# EAGLE design led (EAGLE 6.5.0)
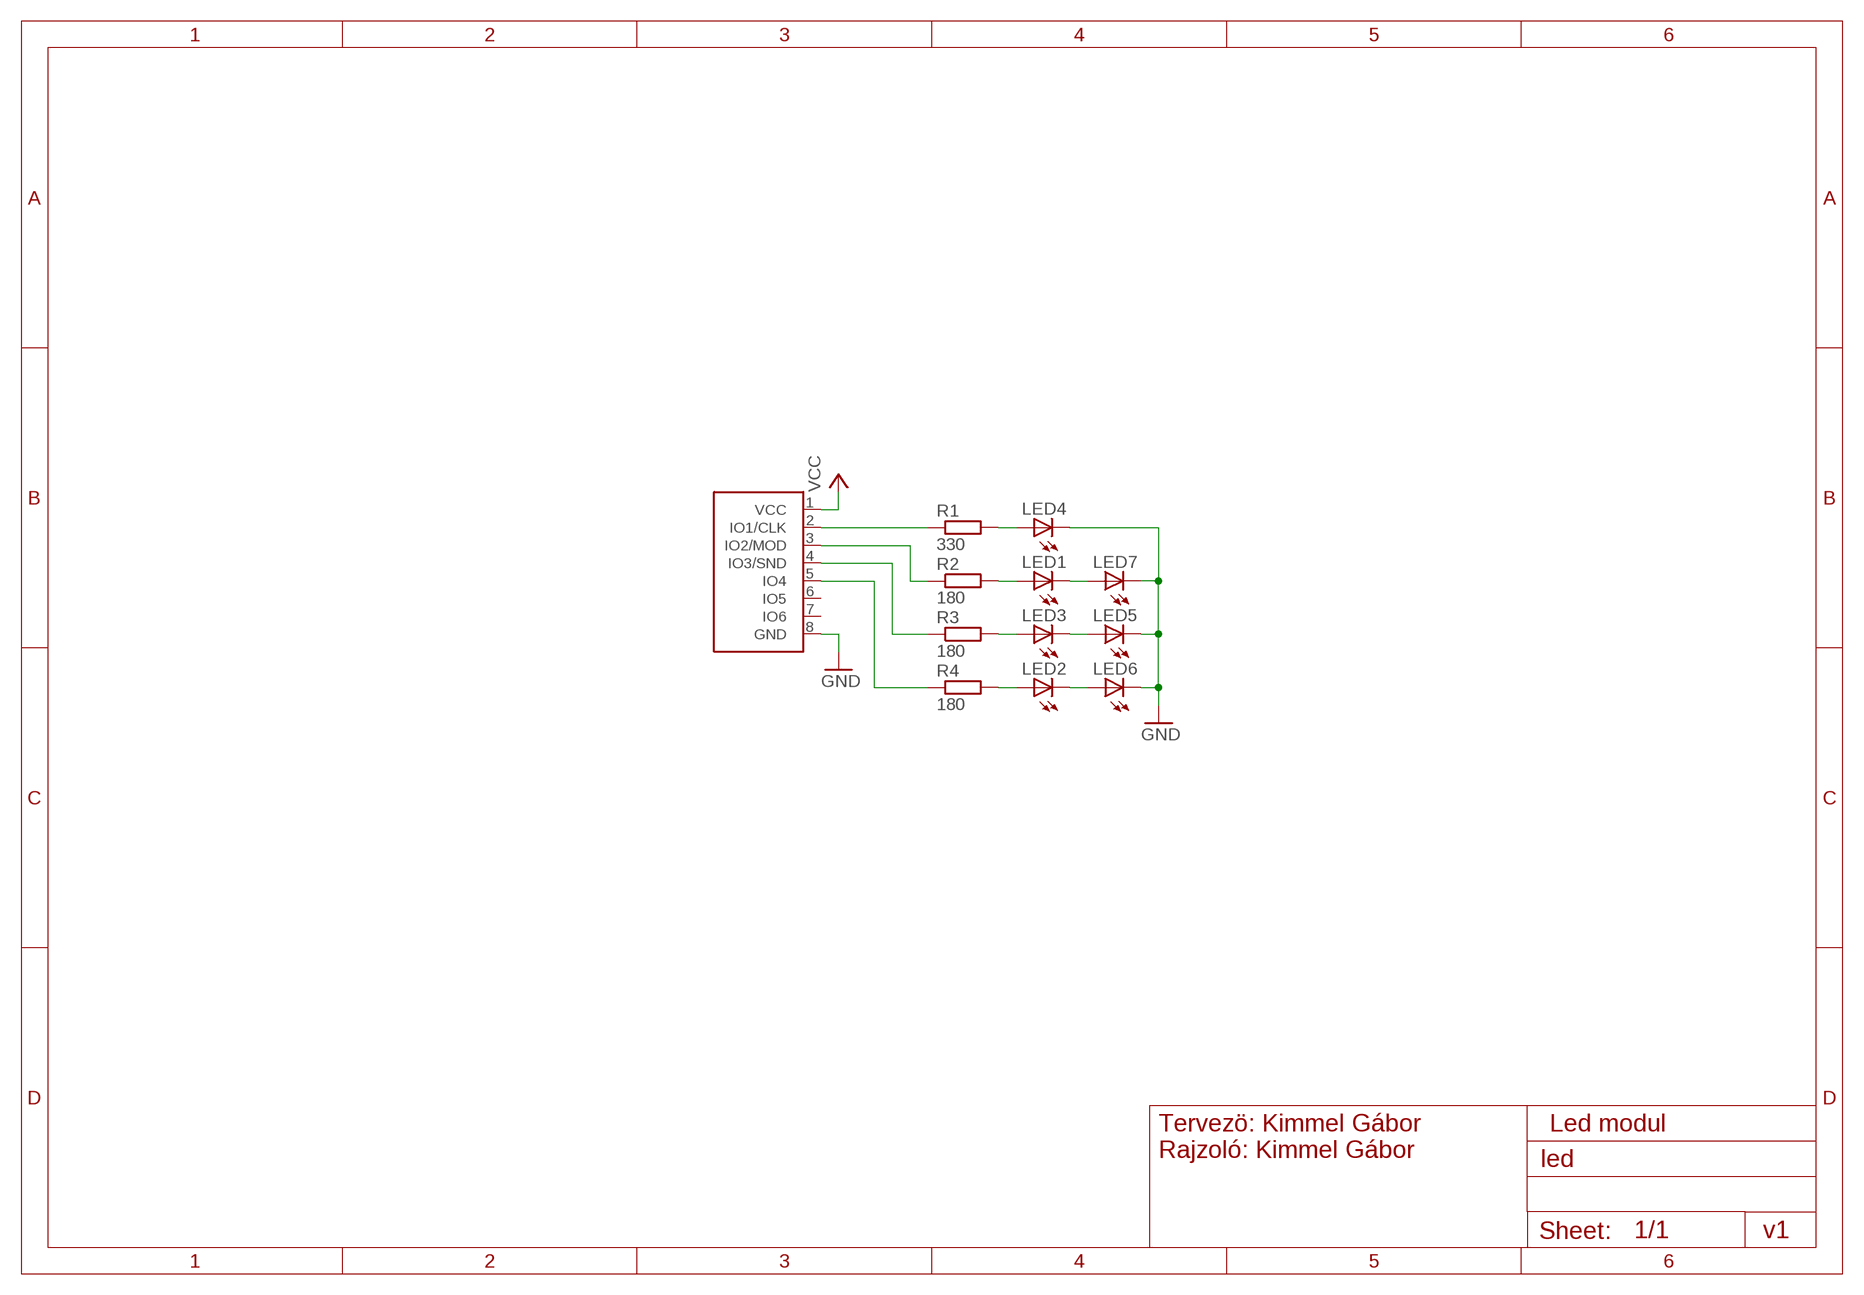
[diagram p0: schematic, sheet 1]

## Parts
LED1  LED5MM  [LED5MM]
LED2  LED5MM  [LED5MM]
LED3  LED5MM  [LED5MM]
LED4  LED5MM  [LED5MM]
LED5  LED5MM  [LED5MM]
LED6  LED5MM  [LED5MM]
LED7  LED5MM  [LED5MM]
R1  330  R-EU_0207/10  [0207/10]
R2  180  R-EU_0207/10  [0207/10]
R3  180  R-EU_0207/10  [0207/10]
R4  180  R-EU_0207/10  [0207/10]
U$1  GANZ-CONNECTOR  [FE08W]

## Nets
GND: LED4.K(C) LED5.K(C) LED6.K(C) LED7.K(C) U$1.8(GND)
N$1: R1.1 U$1.2(IO1/CLK)
N$2: LED4.A R1.2
N$3: LED1.A R2.2
N$4: LED3.A R3.2
N$5: LED2.A R4.2
N$6: LED2.K(C) LED6.A
N$7: LED3.K(C) LED5.A
N$8: LED1.K(C) LED7.A
N$9: R2.1 U$1.3(IO2/MOD)
N$10: R3.1 U$1.4(IO3/SND)
N$11: R4.1 U$1.5(IO4)
VCC: U$1.1(VCC)
Unconnected: U$1.6(IO5) U$1.7(IO6)

## Notes on the sheet
- Tervezö: Kimmel Gábor
  Rajzoló: Kimmel Gábor
- Led modul
- v1

## Library data of the parts
LED1-LED7 = led:LED: LED OSRAM: - CHIPLED LG R971, LG N971, LY N971, LG Q971, LY Q971, LO R971, LY R971 LH N974, LH R974 LS Q976, LO Q976, LY Q976 LO Q996 - Hyper CHIPLED LW Q18S LB Q993, LB Q99A, LB R99A - SideLED LS A670, LO A670, LY A670, LG A670, LP A670 LB A673, LV A673, LT A673, LW A673 LH A674 LY A675 LS A676, LA A676, LO A676, LY A676, LW A676 LS A679, LY A679, LG A679 - Hyper Micro SIDELED® LS Y876, LA Y876, LO Y876, LY Y876 LT Y87S - SmartLED LW L88C, LW L88S LB L89C, LB L89S, LG L890 LS L89K, LO L89K, LY L89K LS L896, LA L896, LO L896, LY L896 - TOPLED LS T670, LO T670, LY T670, LG T670, LP T670 LSG T670, LSP T670, LSY T670, LOP T670, LYG T670 LG T671, LOG T671, LSG T671 LB T673, LV T673, LT T673, LW T673 LH T674 LS T676, LA T676, LO T676, LY T676, LB T676, LH T676, LSB T676, LW T676 LB T67C, LV T67C, LT T67C, LS T67K, LO T67K, LY T67K, LW E67C LS E67B, LA E67B, LO E67B, LY E67B, LB E67C, LV E67C, LT E67C LW T67C LS T679, LY T679, LG T679 LS T770, LO T770, LY T770, LG T770, LP T770 LB T773, LV T773, LT T773, LW T773 LH T774 LS E675, LA E675, LY E675, LS T675 LS T776, LA T776, LO T776, LY T776, LB T776 LHGB T686 LT T68C, LB T68C - Hyper Mini TOPLED® LB M676 - Mini TOPLED Santana® LG M470 LS M47K, LO M47K, LY M47K Source: http://www.osram.convergy.de LUXEON: - LUMILED® LXK2-PW12-R00, LXK2-PW12-S00, LXK2-PW14-U00, LXK2-PW14-V00 LXK2-PM12-R00, LXK2-PM12-S00, LXK2-PM14-U00 LXK2-PE12-Q00, LXK2-PE12-R00, LXK2-PE12-S00, LXK2-PE14-T00, LXK2-PE14-U00 LXK2-PB12-K00, LXK2-PB12-L00, LXK2-PB12-M00, LXK2-PB14-N00, LXK2-PB14-P00, LXK2-PB14-Q00 LXK2-PR12-L00, LXK2-PR12-M00, LXK2-PR14-Q00, LXK2-PR14-R00 LXK2-PD12-Q00, LXK2-PD12-R00, LXK2-PD12-S00 LXK2-PH12-R00, LXK2-PH12-S00 LXK2-PL12-P00, LXK2-PL12-Q00, LXK2-PL12-R00 Source: www.luxeon.com KINGBRIGHT: KA-3528ASYC Source: www.kingbright.com
R1-R4 = resistor:R-EU_: RESISTOR, European symbol
U$1 = ganzlib:GANZ-CONNECTOR

## Board
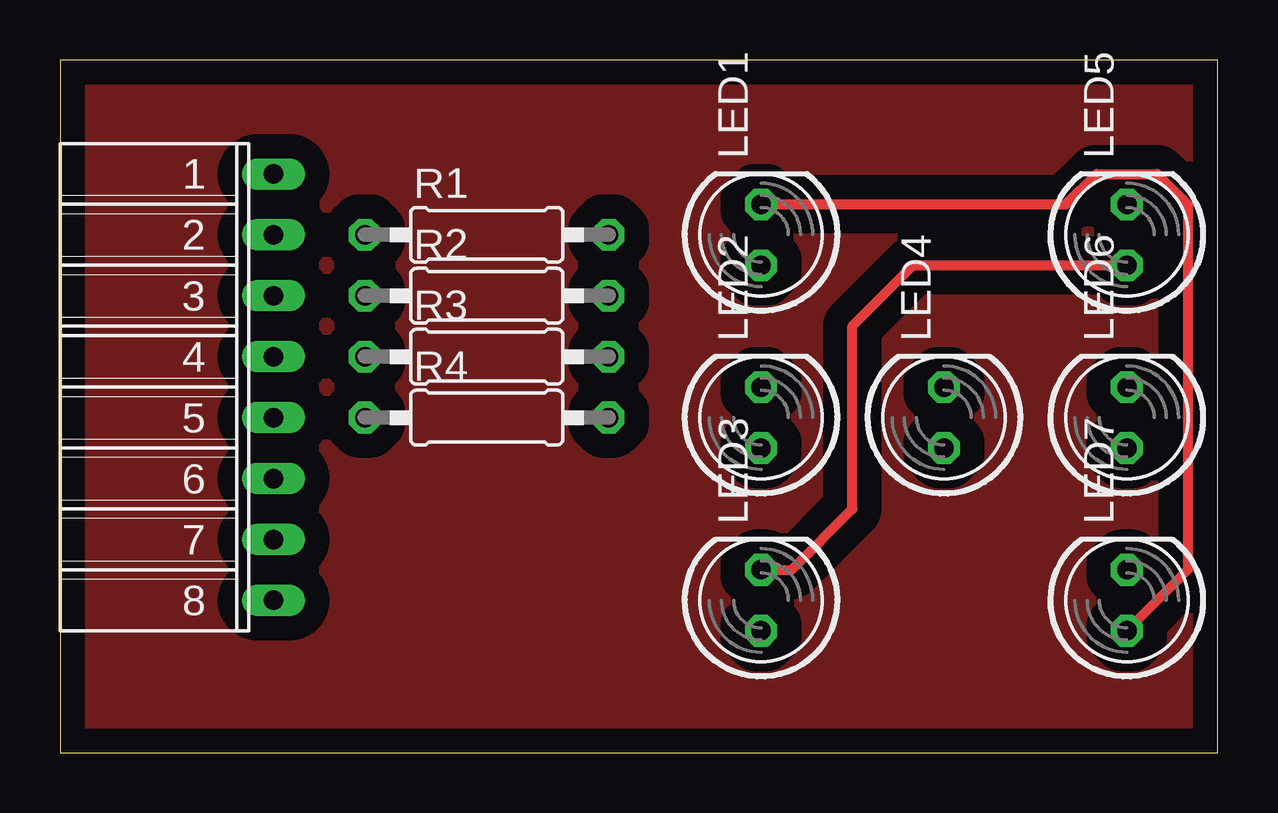
[diagram p1: board, top side]
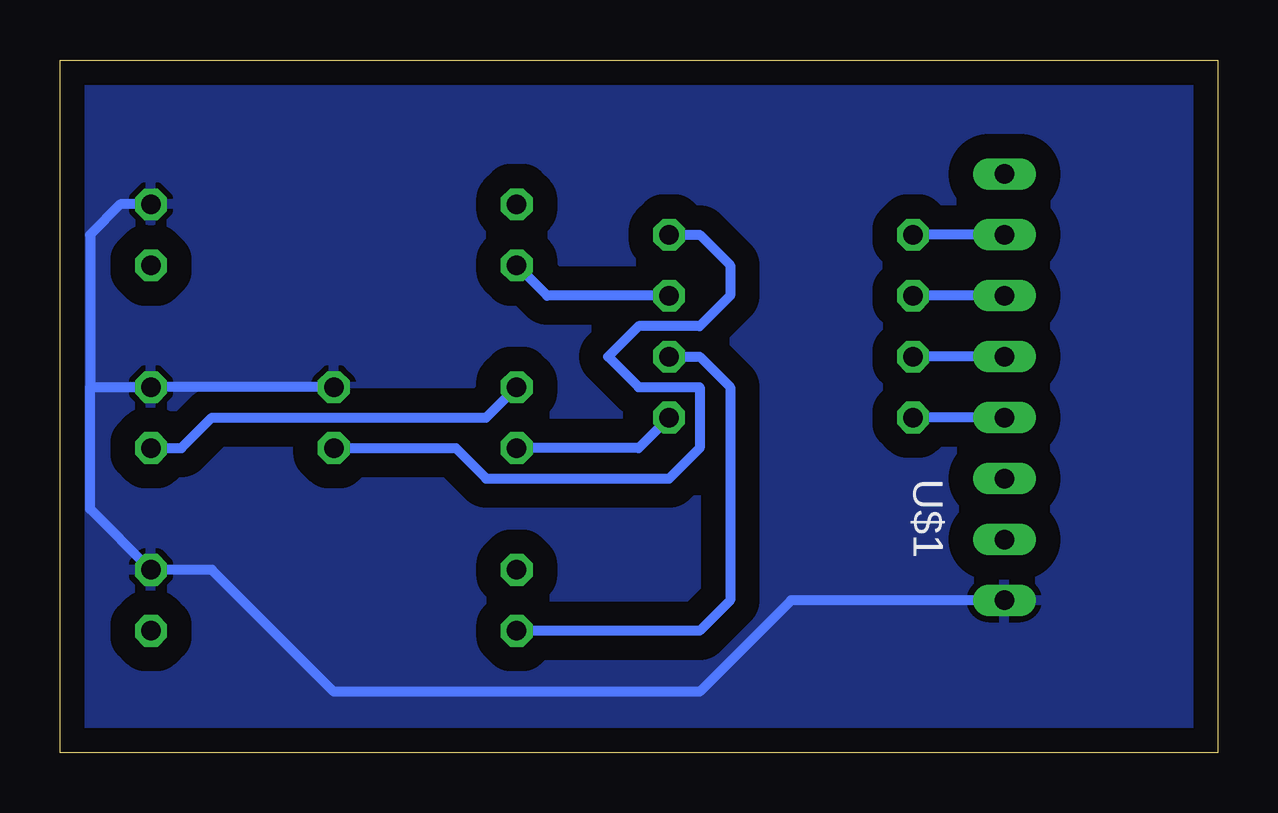
[diagram p2: board, bottom side, seen from below]

Size 48.24 x 28.88 mm. Coordinates in mm from the lower left corner, seen from the top.
Outline: 0,0 48.24,0 48.24,28.88 0,28.88 0,0
Copper layers (1*16): Top 0.035mm / dielectric 1.5mm / Bottom 0.035mm
Design rules "default *": minimum track width 10mil, minimum drill 24mil, track to track 8mil, track to pad 8mil, pad to pad 8mil, via to via 8mil, smd to smd 8mil, copper to edge 40mil, drill to drill 8mil, minimum pad ring 10mil, minimum via ring 8mil, stop-mask expansion 4mil, vias tented up to drill 0mil, thermal gap 10mil

### Footprints (pad centres in the part's own frame; a part is rotated, then mirrored left to right if it is on the bottom)
LED5MM = drill 0.813 octagon: A -1.27,0; K 1.27,0
0207/10 = drill 0.813 octagon: 1 -5.08,0; 2 5.08,0
FE08W = drill 0.813 long: 1 5.08,8.89; 2 5.08,6.35; 3 5.08,3.81; 4 5.08,1.27; 5 5.08,-1.27; 6 5.08,-3.81; 7 5.08,-6.35; 8 5.08,-8.89

### Placement (x,y rotation side)
LED1  29.21,21.59 90 top
LED2  29.21,13.97 90 top
LED3  29.21,6.35 90 top
LED4  36.83,13.97 90 top
LED5  44.45,21.59 90 top
LED6  44.45,13.97 90 top
LED7  44.45,6.35 90 top
R1  17.78,21.59 0 top
R2  17.78,19.05 0 top
R3  17.78,16.51 0 top
R4  17.78,13.97 0 top
U$1  3.81,15.24 0 top

### Tracks (layer width: path | path; a pad name or v marks a point on that pad's centre or on a via)
GND
  Bottom 0.406: 46.99,15.24 46.99,10.16 LED7.K 41.91,7.62 36.83,2.54 21.59,2.54 17.78,6.35 U$1.8 | 46.99,15.24 LED6.K LED4.K | LED5.K 45.72,22.86 46.99,21.59 46.99,15.24
  pour Bottom (isolate 1.016): 0,29.21 48.26,29.21 48.26,0 0,0
N$1
  Bottom 0.406: U$1.2 R1.1
N$2
  Bottom 0.406: LED4.A 31.75,12.7 30.48,11.43 22.86,11.43 21.59,12.7 21.59,15.24 24.13,15.24 25.4,16.51 24.13,17.78 21.59,17.78 20.32,19.05 20.32,20.32 21.59,21.59 R1.2
N$3
  Bottom 0.406: R2.2 27.94,19.05 LED1.A
N$4
  Bottom 0.406: R3.2 21.59,16.51 20.32,15.24 20.32,6.35 21.59,5.08 LED3.A
N$5
  Bottom 0.406: R4.2 24.13,12.7 LED2.A
N$6
  Bottom 0.406: LED6.A 43.18,12.7 41.91,13.97 30.48,13.97 LED2.K
N$7
  Top 0.406: LED3.K 30.48,7.62 33.02,10.16 33.02,17.78 35.56,20.32 LED5.A
N$8
  Top 0.406: LED1.K 41.91,22.86 43.18,24.13 45.72,24.13 46.99,22.86 46.99,7.62 LED7.A
N$9
  Bottom 0.406: U$1.3 R2.1
N$10
  Bottom 0.406: U$1.4 R3.1
N$11
  Bottom 0.406: U$1.5 R4.1
N$12
  pour Top (isolate 1.016): 0,29.21 48.26,29.21 48.26,0 0,0